# Altium schematic sheet I2C.SchDoc
size 420 x 297 mm; DocumentNumber: 10; SheetNumber: 11; SheetTotal: 17
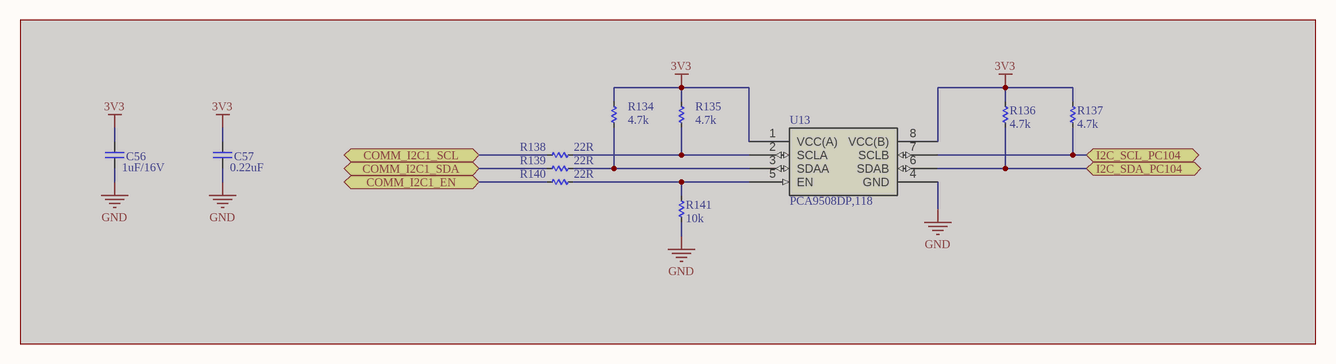
[diagram p0: I2C.SchDoc]

## Parts
C56  1uF/16V  [CAP_C_1608X80]  (masked out: inside a compile mask, not in the netlist)
C57  0.22uF  [CAP_C_1608X80]  (masked out: inside a compile mask, not in the netlist)
R134  4.7k  [RES_C_1608X60]  (masked out: inside a compile mask, not in the netlist)
R135  4.7k  [RES_C_1608X60]  (masked out: inside a compile mask, not in the netlist)
R136  4.7k  [RES_C_1608X60]  (masked out: inside a compile mask, not in the netlist)
R137  4.7k  [RES_C_1608X60]  (masked out: inside a compile mask, not in the netlist)
R138  22R  [RES_C_1608X60]  (masked out: inside a compile mask, not in the netlist)
R139  22R  [RES_C_1608X60]  (masked out: inside a compile mask, not in the netlist)
R140  22R  [RES_C_1608X60]  (masked out: inside a compile mask, not in the netlist)
R141  10k  [RES_C_1608X60]  (masked out: inside a compile mask, not in the netlist)
U13  PCA9508DP,118  [TSSOP8_SOT505-1_NXP]  (masked out: inside a compile mask, not in the netlist)

## Ports
COMM_I2C1_EN (bidir), COMM_I2C1_SCL (bidir), COMM_I2C1_SDA (bidir), I2C_SCL_PC104 (bidir), I2C_SDA_PC104 (bidir)

## Notes on the sheet
- Project:
- BEE-PC1
- Sub-system:
- NANORACK_EXP_CONTROLLER
- Design by:
- SANG HUYNH
- BAO BUI Q.
- Sheet title:
- Sheet
- A3
- of
- Checked by:
- Approved by:
- VU PHAM
- Revision:
- Document No:
- V1.2.2
- Size:
- Date:

## Library data of the parts
C56 C57 = CAP_SMD: CAP_Chip; Value: 33pF
R134-R141 = _RES_B_2: RES
U13 = PCA9508DP,118: No Description Available; Manufacturer_Name: NXP; Copyright: Copyright (C) 2025 Ultra Librarian. All rights reserved.; Manufacturer_Part_Number: PCA9508DP,118; RefDes: RefDes; Type: Type